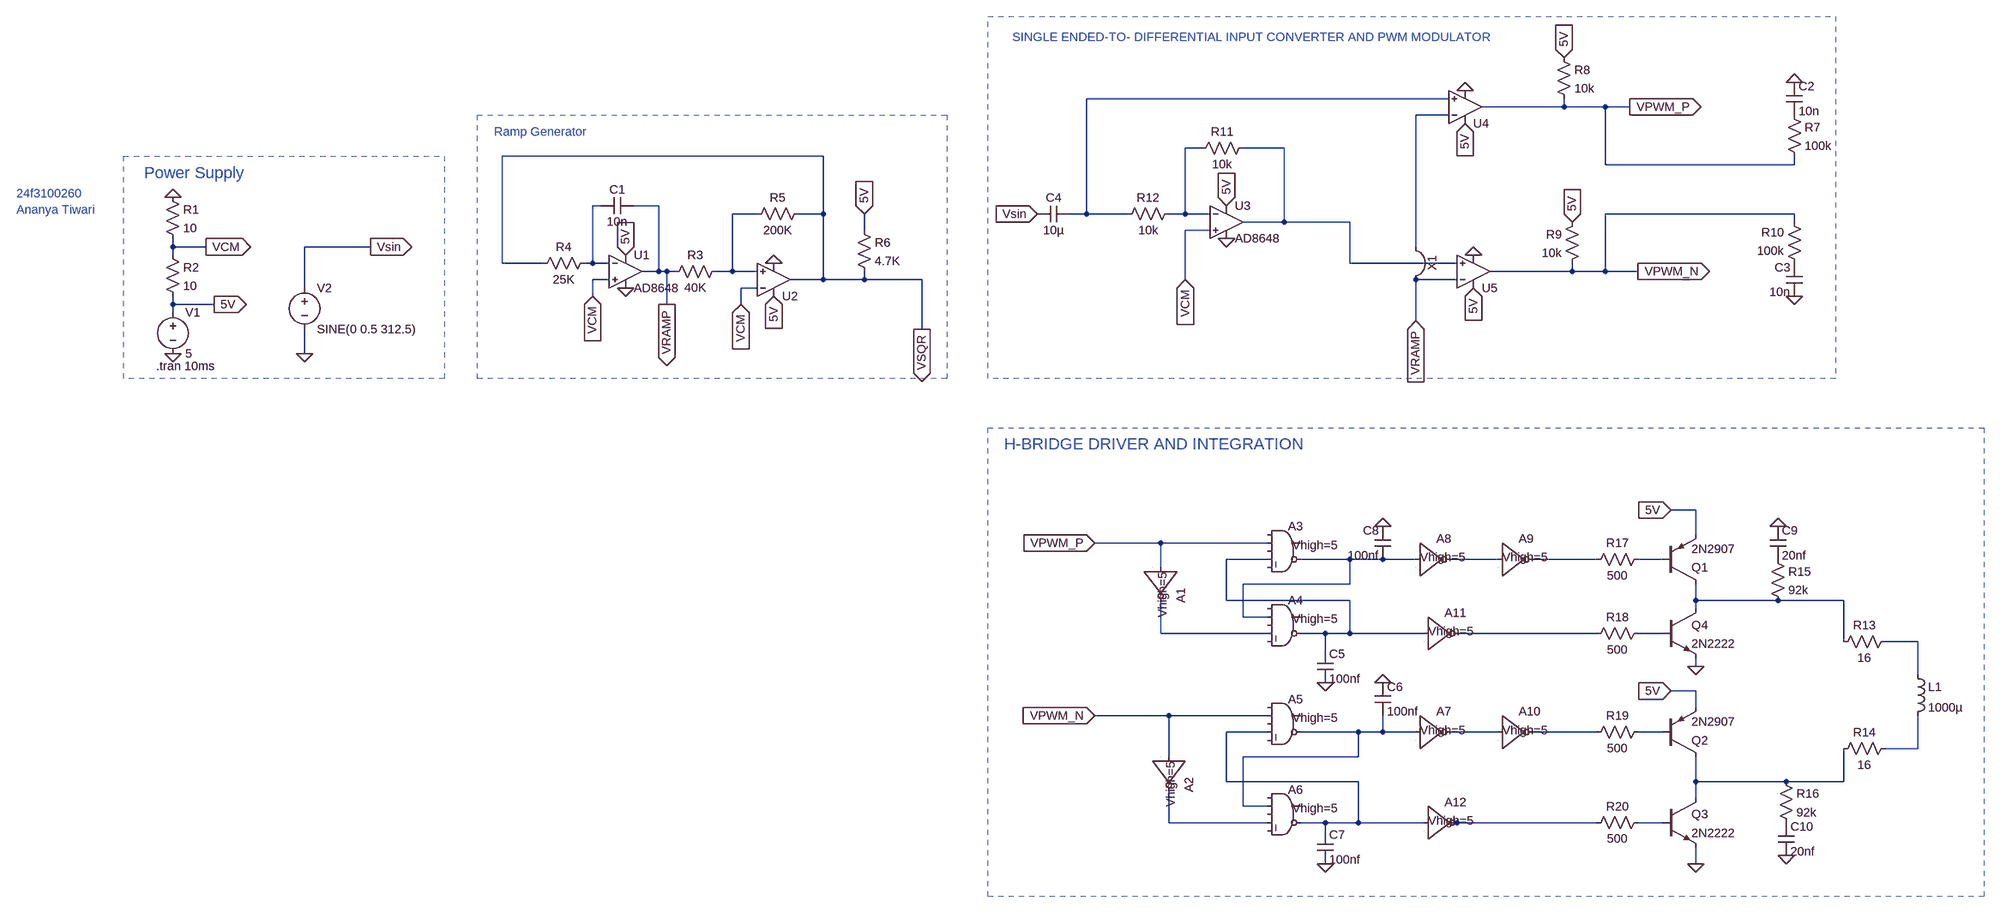
[diagram p0: schematic Lab3.asc]
Lab3.asc, the LTspice schematic file:
Version 4.1
SHEET 1 2196 1492
WIRE 1152 -64 448 -64
WIRE 1376 -48 1376 -64
WIRE 1376 -48 1216 -48
WIRE 1456 -48 1376 -48
WIRE 1504 -48 1456 -48
WIRE 1152 -32 1088 -32
WIRE 672 32 640 32
WIRE 832 32 752 32
WIRE -64 48 -688 48
WIRE 1456 64 1456 -48
WIRE 1824 64 1824 48
WIRE 1824 64 1456 64
WIRE -496 144 -512 144
WIRE -384 144 -432 144
WIRE -192 160 -240 160
WIRE -64 160 -64 48
WIRE -64 160 -112 160
WIRE 448 160 448 -64
WIRE 448 160 416 160
WIRE 528 160 448 160
WIRE 640 160 640 32
WIRE 640 160 608 160
WIRE 688 160 640 160
WIRE 1824 160 1456 160
WIRE 832 176 832 32
WIRE 832 176 752 176
WIRE 960 176 832 176
WIRE 1824 176 1824 160
WIRE 16 192 16 160
WIRE 688 192 640 192
WIRE -1328 224 -1328 208
WIRE -1264 224 -1328 224
WIRE -944 224 -1072 224
WIRE 1088 224 1088 -32
WIRE -1328 240 -1328 224
WIRE -688 256 -688 48
WIRE -608 256 -688 256
WIRE -512 256 -512 144
WIRE -512 256 -528 256
WIRE -480 256 -512 256
WIRE 960 256 960 176
WIRE 1168 256 960 256
WIRE -384 272 -384 144
WIRE -384 272 -416 272
WIRE -368 272 -384 272
WIRE -352 272 -368 272
WIRE -240 272 -240 160
WIRE -240 272 -272 272
WIRE -192 272 -240 272
WIRE 1392 272 1392 256
WIRE 1392 272 1232 272
WIRE 1456 272 1456 160
WIRE 1456 272 1392 272
WIRE 1520 272 1456 272
WIRE -480 288 -512 288
WIRE -64 288 -64 160
WIRE -64 288 -128 288
WIRE 16 288 16 272
WIRE 16 288 -64 288
WIRE 128 288 16 288
WIRE 640 288 640 192
WIRE 1168 288 1088 288
WIRE -1072 304 -1072 224
WIRE -192 304 -224 304
WIRE -512 320 -512 288
WIRE -1328 336 -1328 320
WIRE -1248 336 -1328 336
WIRE -368 336 -368 272
WIRE -224 336 -224 304
WIRE -1328 352 -1328 336
WIRE 1088 368 1088 288
WIRE 128 384 128 288
WIRE -1072 432 -1072 384
WIRE 1632 736 1584 736
WIRE 1632 784 1632 736
WIRE 592 800 464 800
WIRE 800 800 592 800
WIRE 800 832 720 832
WIRE 960 832 864 832
WIRE 1024 832 960 832
WIRE 1088 832 1024 832
WIRE 1248 832 1152 832
WIRE 1440 832 1312 832
WIRE 1568 832 1520 832
WIRE 592 848 592 800
WIRE 960 880 960 832
WIRE 960 880 752 880
WIRE 720 912 720 832
WIRE 960 912 720 912
WIRE 1632 912 1632 880
WIRE 1792 912 1632 912
WIRE 1920 912 1792 912
WIRE 1632 928 1632 912
WIRE 752 944 752 880
WIRE 800 944 752 944
WIRE 592 976 592 912
WIRE 800 976 592 976
WIRE 912 976 864 976
WIRE 960 976 960 912
WIRE 960 976 912 976
WIRE 1104 976 960 976
WIRE 1440 976 1168 976
WIRE 1568 976 1520 976
WIRE 1920 992 1920 912
WIRE 2064 992 2000 992
WIRE 912 1008 912 976
WIRE 1632 1040 1632 1024
WIRE 2064 1056 2064 992
WIRE 1632 1088 1584 1088
WIRE 1632 1120 1632 1088
WIRE 608 1136 464 1136
WIRE 800 1136 608 1136
WIRE 800 1168 720 1168
WIRE 976 1168 864 1168
WIRE 1024 1168 1024 1136
WIRE 1024 1168 976 1168
WIRE 1088 1168 1024 1168
WIRE 1248 1168 1152 1168
WIRE 1440 1168 1312 1168
WIRE 1568 1168 1520 1168
WIRE 2064 1200 2064 1136
WIRE 2064 1200 2000 1200
WIRE 608 1216 608 1136
WIRE 976 1216 976 1168
WIRE 976 1216 752 1216
WIRE 720 1264 720 1168
WIRE 976 1264 720 1264
WIRE 1632 1264 1632 1216
WIRE 1808 1264 1632 1264
WIRE 1920 1264 1920 1200
WIRE 1920 1264 1808 1264
WIRE 1632 1296 1632 1264
WIRE 752 1312 752 1216
WIRE 800 1312 752 1312
WIRE 608 1344 608 1280
WIRE 800 1344 608 1344
WIRE 912 1344 864 1344
WIRE 976 1344 976 1264
WIRE 976 1344 912 1344
WIRE 1104 1344 976 1344
WIRE 1168 1344 1152 1344
WIRE 1440 1344 1168 1344
WIRE 1568 1344 1520 1344
WIRE 912 1360 912 1344
WIRE 1632 1424 1632 1392
FLAG -1328 432 0
FLAG -1328 128 0
FLAG -1264 224 VCM
IOPIN -1264 224 Out
FLAG -1248 336 5V
IOPIN -1248 336 Out
FLAG -1072 432 0
FLAG -944 224 Vsin
IOPIN -944 224 Out
FLAG -512 320 VCM
IOPIN -512 320 In
FLAG 16 160 5V
IOPIN 16 160 In
FLAG 128 384 VSQR
IOPIN 128 384 Out
FLAG -368 336 VRAMP
IOPIN -368 336 Out
FLAG -448 304 0
FLAG -448 240 5V
IOPIN -448 240 In
FLAG -224 336 VCM
IOPIN -224 336 In
FLAG -160 320 5V
IOPIN -160 320 In
FLAG -160 256 0
FLAG 1184 -80 0
FLAG 1200 240 0
FLAG 720 208 0
FLAG 1824 -96 0
FLAG 1376 -144 5V
IOPIN 1376 -144 In
FLAG 1392 176 5V
IOPIN 1392 176 In
FLAG 1824 320 0
FLAG 1504 -48 VPWM_P
IOPIN 1504 -48 Out
FLAG 1520 272 VPWM_N
IOPIN 1520 272 Out
FLAG 1200 304 5V
IOPIN 1200 304 In
FLAG 1184 -16 5V
IOPIN 1184 -16 In
FLAG 720 144 5V
IOPIN 720 144 In
FLAG 352 160 Vsin
IOPIN 352 160 In
FLAG 1088 368 VRAMP
IOPIN 1088 368 In
FLAG 640 288 VCM
IOPIN 640 288 In
FLAG 1632 1424 0
FLAG 1632 1040 0
FLAG 912 1424 0
FLAG 1024 1072 0
FLAG 912 1072 0
FLAG 1584 736 5V
IOPIN 1584 736 In
FLAG 1584 1088 5V
IOPIN 1584 1088 In
FLAG 464 800 VPWM_P
IOPIN 464 800 In
FLAG 464 1136 VPWM_N
IOPIN 464 1136 In
FLAG 1024 768 0
FLAG 1808 1408 0
FLAG 1792 768 0
SYMBOL res -1344 112 R0
SYMATTR InstName R1
SYMATTR Value 10
SYMATTR SpiceLine tol=1 pwr=0.1
SYMBOL res -1344 224 R0
SYMATTR InstName R2
SYMATTR Value 10
SYMBOL voltage -1328 336 R0
WINDOW 123 0 0 Left 0
WINDOW 39 0 0 Left 0
SYMATTR InstName V1
SYMATTR Value 5
SYMBOL voltage -1072 288 R0
WINDOW 123 0 0 Left 0
WINDOW 39 0 0 Left 0
SYMATTR InstName V2
SYMATTR Value SINE(0 0.5 312.5)
SYMBOL OpAmps\\AD8648 -448 208 R0
SYMATTR InstName U1
SYMBOL OpAmps\\UniversalOpAmp2 -160 288 M180
SYMATTR InstName U2
SYMBOL res -256 256 R90
WINDOW 0 0 56 VBottom 2
WINDOW 3 32 56 VTop 2
SYMATTR InstName R3
SYMATTR Value 40K
SYMATTR SpiceLine tol=1 pwr=0
SYMBOL res -512 240 R90
WINDOW 0 0 56 VBottom 2
WINDOW 3 32 56 VTop 2
SYMATTR InstName R4
SYMATTR Value 25K
SYMBOL res -96 144 R90
WINDOW 0 0 56 VBottom 2
WINDOW 3 32 56 VTop 2
SYMATTR InstName R5
SYMATTR Value 200K
SYMBOL cap -432 128 R90
WINDOW 0 0 32 VBottom 2
WINDOW 3 32 32 VTop 2
SYMATTR InstName C1
SYMATTR Value 10n
SYMBOL res 0 176 R0
SYMATTR InstName R6
SYMATTR Value 4.7K
SYMBOL OpAmps\\AD8648 720 112 R0
SYMATTR InstName U3
SYMBOL OpAmps\\UniversalOpAmp2 1184 -48 M180
SYMATTR InstName U4
SYMBOL OpAmps\\UniversalOpAmp2 1200 272 M180
SYMATTR InstName U5
SYMBOL res 1808 -48 R0
SYMATTR InstName R7
SYMATTR Value 100k
SYMBOL cap 1808 -96 R0
SYMATTR InstName C2
SYMATTR Value 10n
SYMBOL res 1360 -160 R0
SYMATTR InstName R8
SYMATTR Value 10k
SYMBOL res 1408 160 M0
SYMATTR InstName R9
SYMATTR Value 10k
SYMBOL res 1840 272 R180
WINDOW 0 36 76 Left 2
WINDOW 3 36 40 Left 2
SYMATTR InstName R10
SYMATTR Value 100k
SYMBOL cap 1840 320 R180
WINDOW 0 24 56 Left 2
WINDOW 3 24 8 Left 2
SYMATTR InstName C3
SYMATTR Value 10n
SYMBOL res 768 16 R90
WINDOW 0 0 56 VBottom 2
WINDOW 3 32 56 VTop 2
SYMATTR InstName R11
SYMATTR Value 10k
SYMBOL res 624 144 R90
WINDOW 0 0 56 VBottom 2
WINDOW 3 32 56 VTop 2
SYMATTR InstName R12
SYMATTR Value 10k
SYMBOL cap 416 144 R90
WINDOW 0 0 32 VBottom 2
WINDOW 3 32 32 VTop 2
SYMATTR InstName C4
SYMATTR Value 10µ
SYMBOL Misc\\jumper 1152 256 R90
SYMATTR InstName X1
SYMBOL Digital\\inv 656 848 R90
WINDOW 39 8 60 Left 2
SYMATTR SpiceLine Vhigh=5
SYMATTR InstName A1
SYMBOL Digital\\inv 672 1216 R90
WINDOW 39 8 60 Left 2
SYMATTR SpiceLine Vhigh=5
SYMATTR InstName A2
SYMBOL Digital\\and 832 752 R0
WINDOW 40 16 52 Left 2
SYMATTR SpiceLine2 Vhigh=5
SYMATTR InstName A3
SYMBOL Digital\\and 832 896 R0
WINDOW 39 16 52 Left 2
SYMATTR SpiceLine Vhigh=5
SYMATTR InstName A4
SYMBOL Digital\\and 832 1088 R0
WINDOW 39 16 52 Left 2
SYMATTR SpiceLine Vhigh=5
SYMATTR InstName A5
SYMBOL Digital\\and 832 1264 R0
WINDOW 39 16 52 Left 2
SYMATTR SpiceLine Vhigh=5
SYMATTR InstName A6
SYMBOL pnp 1568 880 M180
SYMATTR InstName Q1
SYMATTR Value 2N2907
SYMBOL pnp 1568 1216 M180
SYMATTR InstName Q2
SYMATTR Value 2N2907
SYMBOL npn 1568 1296 R0
SYMATTR InstName Q3
SYMATTR Value 2N2222
SYMBOL npn 1568 928 R0
SYMATTR InstName Q4
SYMATTR Value 2N2222
SYMBOL res 2016 976 R90
WINDOW 0 0 56 VBottom 2
WINDOW 3 32 56 VTop 2
SYMATTR InstName R13
SYMATTR Value 16
SYMBOL res 2016 1184 R90
WINDOW 0 0 56 VBottom 2
WINDOW 3 32 56 VTop 2
SYMATTR InstName R14
SYMATTR Value 16
SYMBOL Digital\\inv 1088 1104 R0
WINDOW 39 8 60 Left 2
SYMATTR SpiceLine Vhigh=5
SYMATTR InstName A7
SYMBOL cap 896 1008 R0
SYMATTR InstName C5
SYMATTR Value 100nf
SYMBOL cap 1008 1072 R0
SYMATTR InstName C6
SYMATTR Value 100nf
SYMBOL cap 896 1360 R0
SYMATTR InstName C7
SYMATTR Value 100nf
SYMBOL Digital\\inv 1088 768 R0
WINDOW 39 8 60 Left 2
SYMATTR SpiceLine Vhigh=5
SYMATTR InstName A8
SYMBOL Digital\\inv 1248 768 R0
WINDOW 39 8 60 Left 2
SYMATTR SpiceLine Vhigh=5
SYMATTR InstName A9
SYMBOL Digital\\inv 1248 1104 R0
WINDOW 39 8 60 Left 2
SYMATTR SpiceLine Vhigh=5
SYMATTR InstName A10
SYMBOL cap 1040 832 R180
WINDOW 0 24 56 Left 2
WINDOW 3 24 8 Left 2
SYMATTR InstName C8
SYMATTR Value 100nf
SYMBOL Digital\\inv 1104 912 R0
WINDOW 39 8 60 Left 2
SYMATTR SpiceLine Vhigh=5
SYMATTR InstName A11
SYMBOL Digital\\inv 1104 1280 R0
WINDOW 39 8 60 Left 2
SYMATTR SpiceLine Vhigh=5
SYMATTR InstName A12
SYMBOL res 1776 816 R0
SYMATTR InstName R15
SYMATTR Value 92k
SYMBOL res 1792 1248 R0
SYMATTR InstName R16
SYMATTR Value 92k
SYMBOL cap 1776 768 R0
SYMATTR InstName C9
SYMATTR Value 20nf
SYMBOL cap 1792 1344 R0
SYMATTR InstName C10
SYMATTR Value 20nf
SYMBOL ind 2048 1040 R0
SYMATTR InstName L1
SYMATTR Value 1000µ
SYMBOL res 1536 816 R90
WINDOW 0 0 56 VBottom 2
WINDOW 3 32 56 VTop 2
SYMATTR InstName R17
SYMATTR Value 500
SYMBOL res 1536 960 R90
WINDOW 0 0 56 VBottom 2
WINDOW 3 32 56 VTop 2
SYMATTR InstName R18
SYMATTR Value 500
SYMBOL res 1536 1152 R90
WINDOW 0 0 56 VBottom 2
WINDOW 3 32 56 VTop 2
SYMATTR InstName R19
SYMATTR Value 500
SYMBOL res 1536 1328 R90
WINDOW 0 0 56 VBottom 2
WINDOW 3 32 56 VTop 2
SYMATTR InstName R20
SYMATTR Value 500
TEXT -1360 456 Left 2 !.tran 10ms
TEXT -1384 80 Left 3 ;Power Supply
TEXT -704 0 Left 2 ;Ramp Generator
TEXT 304 -184 Left 2 ;SINGLE ENDED-TO- DIFFERENTIAL INPUT CONVERTER AND PWM MODULATOR
TEXT -1632 120 Left 2 ;24f3100260
TEXT -1632 152 Left 2 ;Ananya Tiwari
TEXT 288 608 Left 3 ;H-BRIDGE DRIVER AND INTEGRATION
RECTANGLE Normal -800 480 -1424 48 2
RECTANGLE Normal 176 480 -736 -32 2
RECTANGLE Normal 1904 480 256 -224 2
RECTANGLE Normal 2192 1488 256 576 2

The netlist it stands for:
* Lab3.asc
R1 0 VCM 10 tol=1 pwr=0.1
R2 VCM 5V 10
V1 5V 0 5
V2 Vsin 0 SINE(0 0.5 312.5)
X§U1 VCM N004 5V 0 VRAMP AD8648  ; pins In+ In- V+ V- OUT
X§U2 N005 VCM 5V 0 VSQR level2 Avol=1Meg GBW=10Meg Slew=10Meg Ilimit=25m Rail=0 Vos=0 En=0 Enk=0 In=0 Ink=0 Rin=500Meg  ; pins In+ In- V+ V- OUT
R3 N005 VRAMP 40K tol=1 pwr=0
R4 N004 VSQR 25K
R5 VSQR N005 200K
C1 VRAMP N004 10n
R6 5V VSQR 4.7K
X§U3 VCM N002 5V 0 N003 AD8648  ; pins In+ In- V+ V- OUT
X§U4 N001 VRAMP 5V 0 VPWM_P level2 Avol=1Meg GBW=10Meg Slew=10Meg Ilimit=25m Rail=0 Vos=0 En=0 Enk=0 In=0 Ink=0 Rin=500Meg  ; pins In+ In- V+ V- OUT
X§U5 N003 VRAMP 5V 0 VPWM_N level2 Avol=1Meg GBW=10Meg Slew=10Meg Ilimit=25m Rail=0 Vos=0 En=0 Enk=0 In=0 Ink=0 Rin=500Meg  ; pins In+ In- V+ V- OUT
R7 P001 VPWM_P 100k
C2 0 P001 10n
R8 5V VPWM_P 10k
R9 5V VPWM_N 10k
R10 P002 VPWM_N 100k
C3 0 P002 10n
R11 N003 N002 10k
R12 N002 N001 10k
C4 N001 Vsin 10µ
A1 VPWM_P 0 0 0 0 N012 0 0 BUF Vhigh=5
A2 VPWM_N 0 0 0 0 N023 0 0 BUF Vhigh=5
A3 0 VPWM_P 0 N006 0 N007 0 0 AND Vhigh=5
A4 0 N007 0 N012 0 N006 0 0 AND Vhigh=5
A5 0 VPWM_N 0 N016 0 N017 0 0 AND Vhigh=5
A6 0 N017 0 N023 0 N016 0 0 AND Vhigh=5
Q1 N011 N010 5V 0 2N2907
Q2 N022 N020 5V 0 2N2907
Q3 N022 N025 0 0 2N2222
Q4 N011 N014 0 0 2N2222
R13 N015 N011 16
R14 N021 N022 16
A7 N017 0 0 0 0 N018 0 0 BUF Vhigh=5
C5 N006 0 100nf
C6 0 N017 100nf
C7 N016 0 100nf
A8 N007 0 0 0 0 N008 0 0 BUF Vhigh=5
A9 N008 0 0 0 0 N009 0 0 BUF Vhigh=5
A10 N018 0 0 0 0 N019 0 0 BUF Vhigh=5
C8 N007 0 100nf
A11 N006 0 0 0 0 N013 0 0 BUF Vhigh=5
A12 N016 0 0 0 0 N024 0 0 BUF Vhigh=5
R15 P003 N011 92k
R16 N022 P004 92k
C9 0 P003 20nf
C10 P004 0 20nf
L1 N015 N021 1000µ
R17 N010 N009 500
R18 N014 N013 500
R19 N020 N019 500
R20 N025 N024 500
.model NPN NPN
.model PNP PNP
.lib standard.bjt
.tran 10ms
* Power Supply
* Ramp Generator
* SINGLE ENDED-TO- DIFFERENTIAL INPUT CONVERTER AND PWM MODULATOR
* 24f3100260
* Ananya Tiwari
* H-BRIDGE DRIVER AND INTEGRATION
.lib ADI.lib
.lib UniversalOpAmp2.lib
.backanno
.end